# Altium schematic sheet Ethernet.SchDoc
size A4; DrawnBy: Forrest Gu; DocumentNumber: 1; Revision: 1.0; SheetNumber: 1; SheetTotal: 5
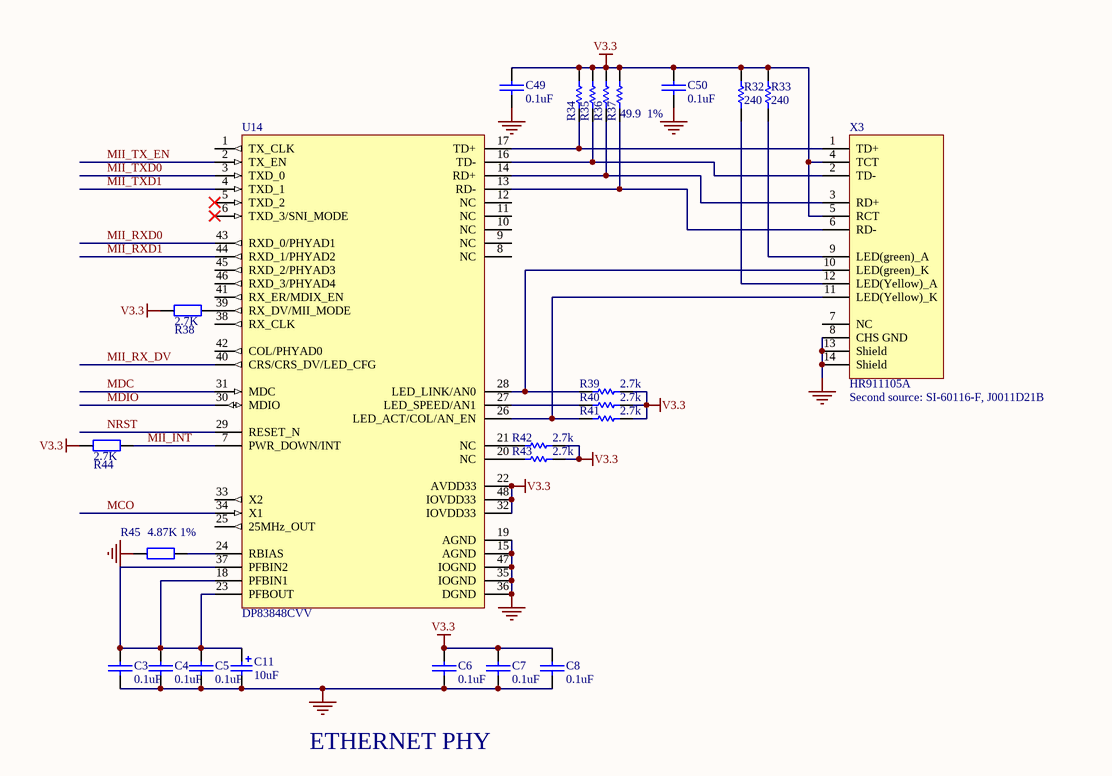
[diagram p0: Ethernet.SchDoc]

## Parts
C3  0.1uF  [0603]
C4  0.1uF  [0603]
C5  0.1uF  [0603]
C6  0.1uF  [0603]
C7  0.1uF  [0603]
C8  0.1uF  [0603]
C11  10uF  [0805]
C49  0.1uF  [0603]
C50  0.1uF  [0603]
R32  240  [0603R]
R33  240  [0603R]
R34  49.9  1%  [0603R]  (value not drawn)
R35  49.9  1%  [0603R]  (value not drawn)
R36  49.9  1%  [0603R]  (value not drawn)
R37  49.9  1%  [0603R]
R38  2.7K  [0603R]
R39  2.7k  [0603R]
R40  2.7k  [0603R]
R41  2.7k  [0603R]
R42  2.7k  [0603R]
R43  2.7k  [0603R]
R44  2.7K  [0603R]
R45  4.87K 1%  [0603R]
U14  DP83848CVV  [LQFP48S]
X3  HR911105A  [HR911105A]

## Nets
GND: C3.2 C4.1 C5.1 C6.2 C7.1 C8.1 C11.2 C49.1 C50.1 R45.2 U14.15(AGND) U14.19(AGND) U14.35(IOGND) U14.36(DGND) U14.47(IOGND) X3.8(CHS_GND) X3.13(Shield) X3.14(Shield)
V3.3: C6.1 C7.2 C8.2 C49.2 C50.2 R32.2 R33.2 R34.2 R35.2 R36.2 R37.2 R38.2 R39.2 R40.2 R41.2 R42.2 R43.2 R44.2 U14.22(AVDD33) U14.32(IOVDD33) U14.48(IOVDD33) X3.4(TCT) X3.5(RCT)
MCO: U14.34(X1)
MDC: U14.31(MDC)
MDIO: U14.30(MDIO)
MII_INT: R44.1 U14.7(PWR_DOWN/INT)
MII_RX_DV: U14.40(CRS/CRS_DV/LED_CFG)
MII_RXD0: U14.43(RXD_0/PHYAD1)
MII_RXD1: U14.44(RXD_1/PHYAD2)
MII_TX_EN: U14.2(TX_EN)
MII_TXD0: U14.3(TXD_0)
MII_TXD1: U14.4(TXD_1)
NRST: U14.29(RESET_N)
NetC3_1: C3.1 C4.2 C5.2 C11.1 U14.18(PFBIN1) U14.23(PFBOUT) U14.37(PFBIN2)
NetR32_1: R32.1 X3.12(LED(Yellow)_A)
NetR33_1: R33.1 X3.9(LED(green)_A)
NetR34_1: R34.1 U14.17(TD+) X3.1(TD+)
NetR35_1: R35.1 U14.16(TD-) X3.2(TD-)
NetR36_1: R36.1 U14.14(RD+) X3.3(RD+)
NetR37_1: R37.1 U14.13(RD-) X3.6(RD-)
NetR38_1: R38.1 U14.39(RX_DV/MII_MODE)
NetR39_1: R39.1 U14.28(LED_LINK/AN0) X3.10(LED(green)_K)
NetR40_1: R40.1 U14.27(LED_SPEED/AN1)
NetR41_1: R41.1 U14.26(LED_ACT/COL/AN_EN) X3.11(LED(Yellow)_K)
NetR42_1: R42.1 U14.21(NC)
NetR43_1: R43.1 U14.20(NC)
NetR45_1: R45.1 U14.24(RBIAS)

Not connected (* = marked no-connect by the designer): U14 1(TX_CLK) 5(TXD_2)* 6(TXD_3/SNI_MODE)* 8(NC) 9(NC) 10(NC) 11(NC) 12(NC) 25(25MHz_OUT) 33(X2) 38(RX_CLK) 41(RX_ER/MDIX_EN) 42(COL/PHYAD0) 45(RXD_2/PHYAD3) 46(RXD_3/PHYAD4); X3 7(NC)

## Notes on the sheet
- (near X3) Second source: SI-60116-F, J0011D21B
- ETHERNET PHY

## Library data of the parts
C3-C8 C49 C50 = CAP: Capacitor
C11 = Cap Pol1: Polarized Capacitor (Radial); Published: 8-Jun-2000; Revision: July-2002: Re-released for DXP Platform.; Publisher: Altium Limited; Value: 10uF
R32-R37 R39-R43 = Res1: Resistor; Value: 1K; Published: 8-Jun-2000; Revision: July-2002: Re-released for DXP Platform.; Publisher: Altium Limited
R38 R44 R45 = Res2: Resistor; Value: 10K; Published: 8-Jun-2000; LatestRevisionDate: 17-Jul-2002; LatestRevisionNote: Re-released for DXP Platform.; PackageReference: AXIAL-0.4; Publisher: Altium Limited
X3 = J0011D21B